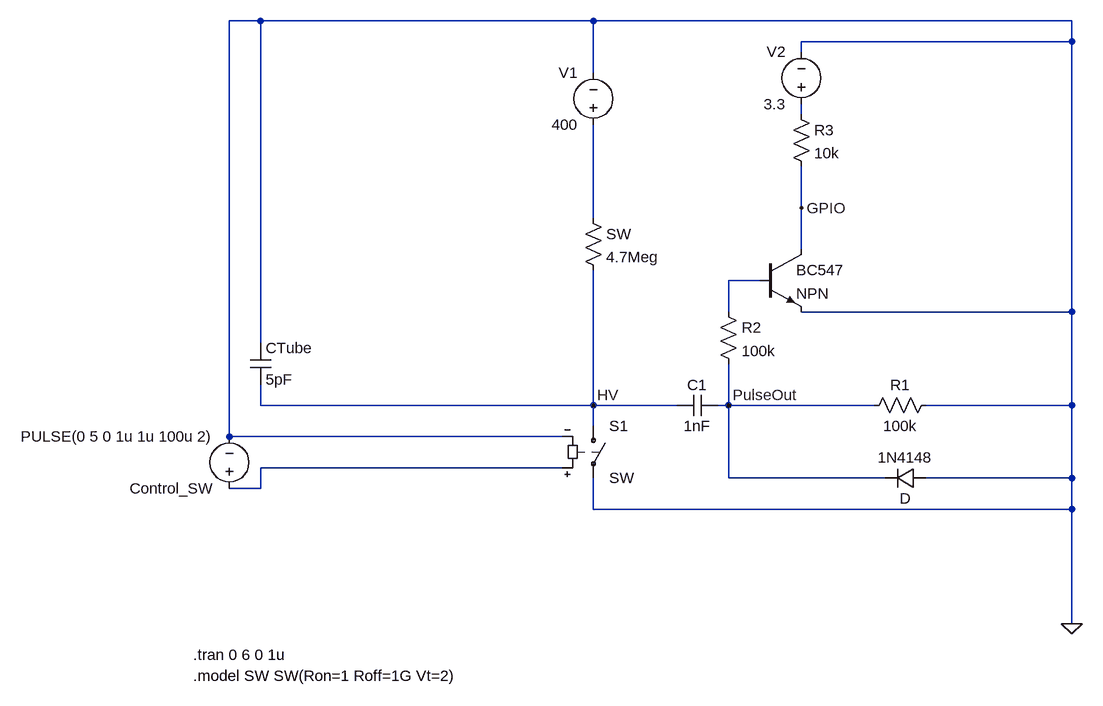
[diagram p0: schematic si22g-simulation.asc]
si22g-simulation.asc, the LTspice schematic file:
Version 4.1
SHEET 1 1012 680
WIRE -256 -352 -304 -352
WIRE 256 -352 -256 -352
WIRE 992 -352 256 -352
WIRE 992 -320 992 -352
WIRE 992 -320 576 -320
WIRE 576 -304 576 -320
WIRE 256 -272 256 -352
WIRE 576 -208 576 -224
WIRE 576 -64 576 -128
WIRE 256 -48 256 -192
WIRE 576 0 576 -64
WIRE 512 48 464 48
WIRE 464 96 464 48
WIRE 992 96 992 -320
WIRE 992 96 576 96
WIRE -256 144 -256 -352
WIRE -256 240 -256 208
WIRE 256 240 256 32
WIRE 256 240 -256 240
WIRE 384 240 256 240
WIRE 464 240 464 176
WIRE 464 240 448 240
WIRE 688 240 464 240
WIRE 992 240 992 96
WIRE 992 240 768 240
WIRE 256 272 256 240
WIRE -304 288 -304 -352
WIRE 208 288 -304 288
WIRE 208 336 -256 336
WIRE 464 352 464 240
WIRE 704 352 464 352
WIRE 992 352 992 240
WIRE 992 352 768 352
WIRE -256 368 -256 336
WIRE -256 368 -304 368
WIRE 256 400 256 352
WIRE 992 400 992 352
WIRE 992 400 256 400
WIRE 992 576 992 400
FLAG 992 576 0
FLAG 256 240 HV
FLAG 464 240 PulseOut
FLAG 576 -64 GPIO
SYMBOL res 240 -64 R0
SYMATTR InstName SW
SYMATTR Value 4.7Meg
SYMBOL voltage 256 -176 R180
WINDOW 0 24 96 Left 2
WINDOW 3 24 16 Left 2
WINDOW 123 0 0 Left 0
WINDOW 39 0 0 Left 0
SYMATTR InstName V1
SYMATTR Value 400
SYMBOL sw 256 256 R0
SYMATTR InstName S1
SYMBOL voltage -304 384 R180
WINDOW 123 0 0 Left 0
WINDOW 39 0 0 Left 0
SYMATTR InstName Control_SW
SYMATTR Value PULSE(0 5 0 1u 1u 100u 2)
SYMBOL cap 448 224 R90
WINDOW 0 0 32 VBottom 2
WINDOW 3 32 32 VTop 2
SYMATTR InstName C1
SYMATTR Value 1nF
SYMBOL res 784 224 R90
WINDOW 0 0 56 VBottom 2
WINDOW 3 32 56 VTop 2
SYMATTR InstName R1
SYMATTR Value 100k
SYMBOL diode 768 336 R90
WINDOW 0 0 32 VBottom 2
WINDOW 3 32 32 VTop 2
SYMATTR InstName 1N4148
SYMBOL npn 512 0 R0
SYMATTR InstName BC547
SYMBOL res 448 80 R0
SYMATTR InstName R2
SYMATTR Value 100k
SYMBOL res 560 -224 R0
SYMATTR InstName R3
SYMATTR Value 10k
SYMBOL voltage 576 -208 R180
WINDOW 0 24 96 Left 2
WINDOW 3 24 16 Left 2
WINDOW 123 0 0 Left 0
WINDOW 39 0 0 Left 0
SYMATTR InstName V2
SYMATTR Value 3.3
SYMBOL cap -272 144 R0
SYMATTR InstName CTube
SYMATTR Value 5pF
TEXT -360 656 Left 2 !.model SW SW(Ron=1 Roff=1G Vt=2)
TEXT -360 624 Left 2 !.tran 0 6 0 1u

The netlist it stands for:
* si22g-simulation.asc
R§SW N002 HV 4.7Meg
V1 N002 0 400
S1 HV 0 N004 0 SW
V§Control_SW N004 0 PULSE(0 5 0 1u 1u 100u 2)
C1 PulseOut HV 1nF
R1 0 PulseOut 100k
D§1N4148 0 PulseOut D
Q§BC547 GPIO N003 0 0 NPN
R2 N003 PulseOut 100k
R3 N001 GPIO 10k
V2 N001 0 3.3
CTube 0 HV 5pF
.model D D
.lib standard.dio
.model NPN NPN
.model PNP PNP
.lib standard.bjt
.model SW SW(Ron=1 Roff=1G Vt=2)
.tran 0 6 0 1u
.backanno
.end